# EasyEDA Pro project ProProject_Hi3861_v2.1_2024-07-26.epro, board PCB1
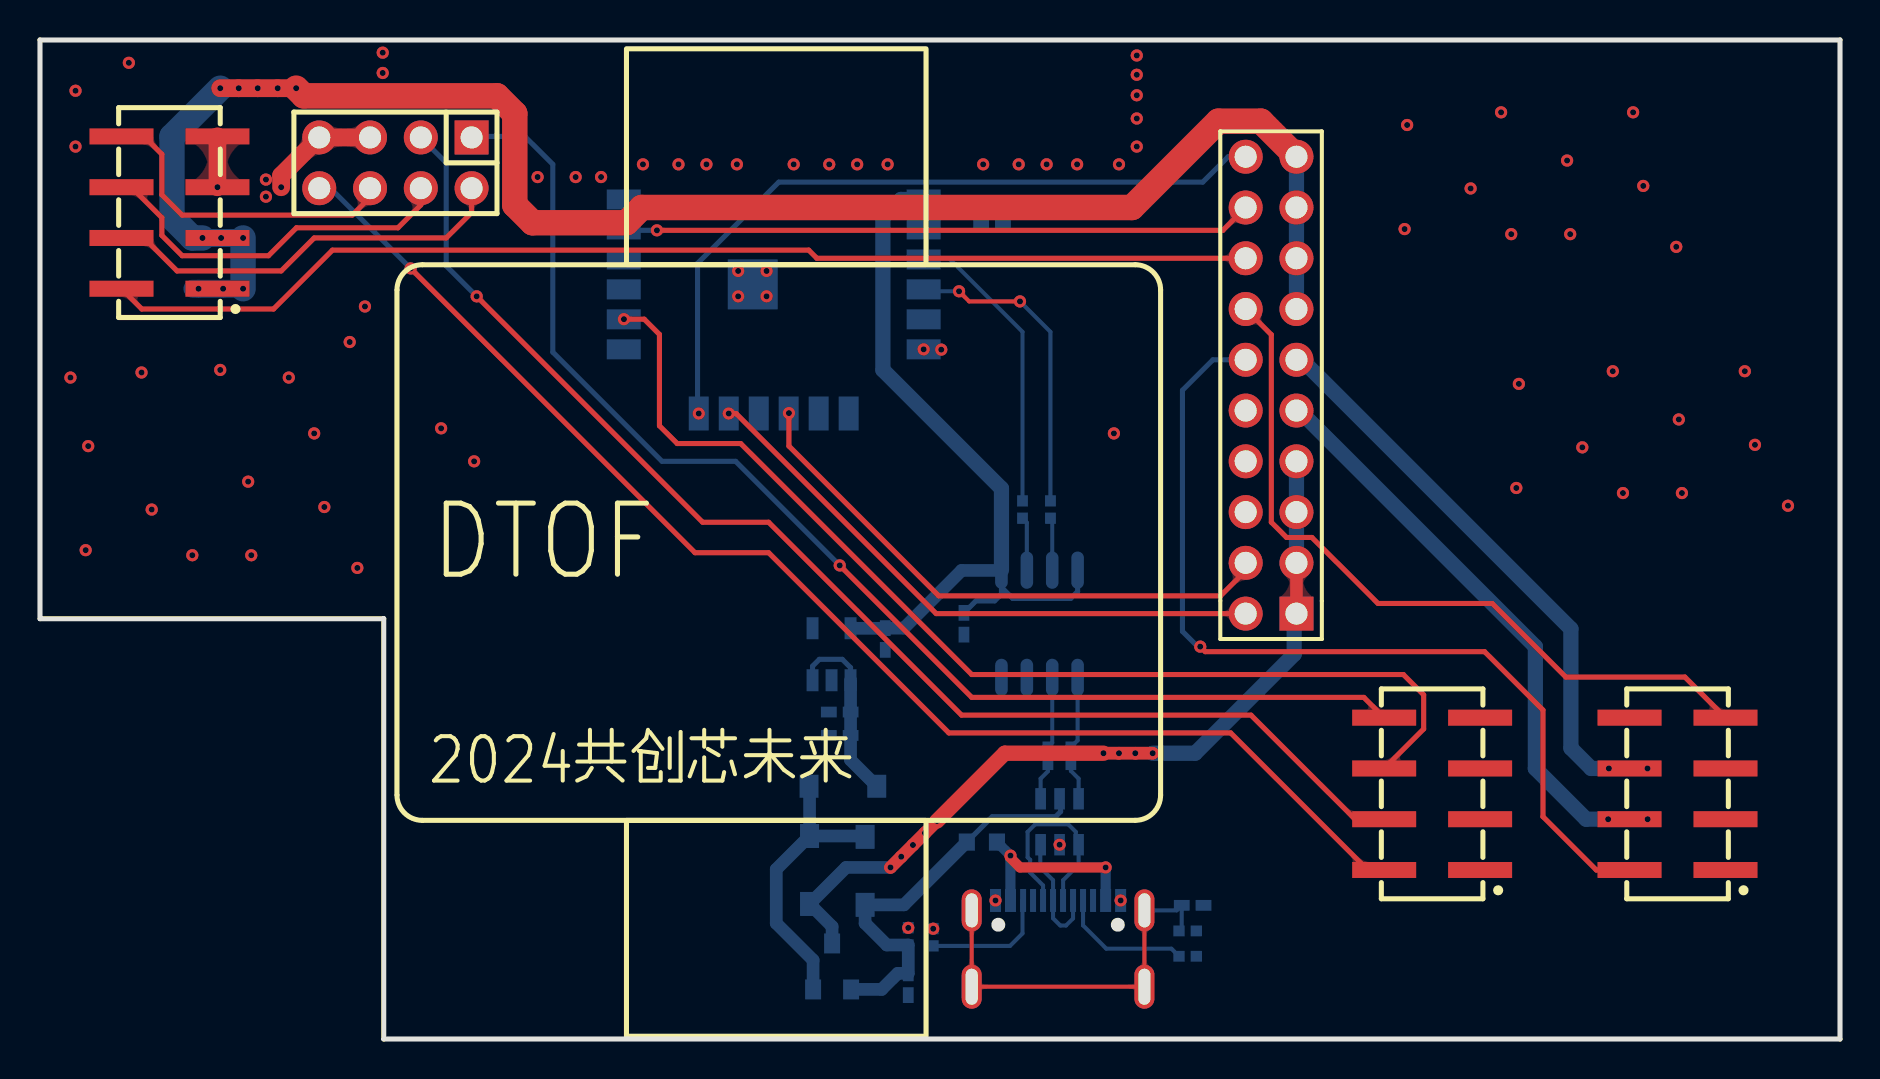
[diagram p6: board, top side]
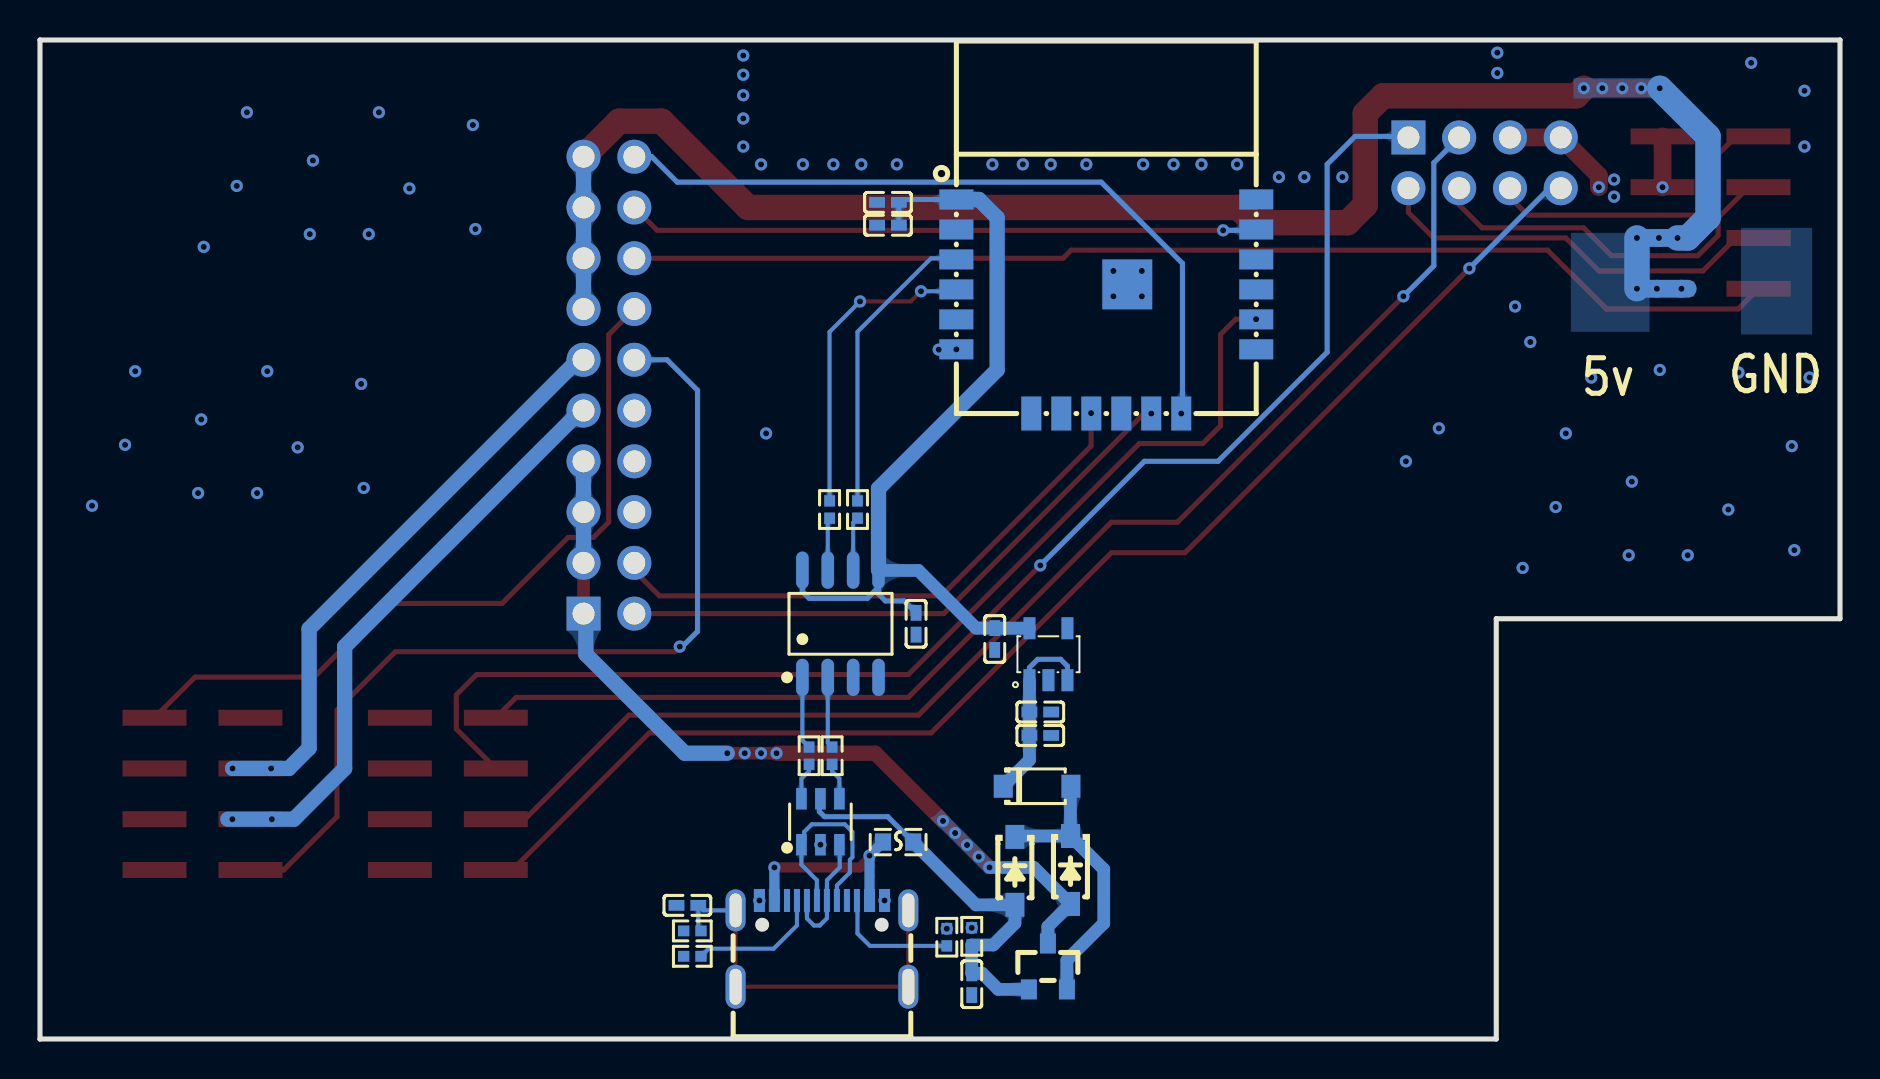
[diagram p7: board, bottom side, seen from below]

Outline 90.04 x 49.99 mm; copper layers: Top Layer, Bottom Layer. Coordinates in mm from the lower left corner of the outline.
Outline path: 0,49.99 0,21.03 17.2,21.03 17.2,0 90.04,0 90.04,49.99 0,49.99
Stack: Top Layer 0.035mm / Dielectric1 1.51mm FR4 er 4.5 / Bottom Layer 0.035mm

## Design rules (mm)
template: JLCPCB Capability(Two Layers Board)
spacing copperThickness1oz (default): track to track 0.102, other pairs 0.152 to 0.3
spacing copperThickness2oz: track to track 0.203, other pairs 0.152 to 0.3
track width copperThickness1oz (default): min 0.127, default 0.254, max 2.54
track width copperThickness2oz: min 0.203, default 0.254, max 2.54
differential pair differentialPair (default): width min 0.127, default 0.254, max 2.54; gap min 0.152, default 0.152
via viaSize (default): diameter min 0.5, default 0.61, max 10; hole min 0.3, default 0.305, max 6.3

## Placement (name value [footprint] x y rotation side)
C4  100nF  [C0402]  46.22 20.78 90 bottom
C12  47nf  [C0402]  43.43 2.74 90 bottom
C14  10u  [C0402]  40 15.19 180 bottom
C15  100nF  [C0402]  40 16.36 180 bottom
C16  10u  [C0402]  42.28 20.02 270 bottom
C28  2u  [C0402]  47.62 41.86 180 bottom
C29  100nF  [C0402]  47.62 40.72 180 bottom
C51  100nF  [C0402]  57.66 6.69 180 bottom
CN3  PM254-2-04-S-8.5  [HDR-SMD_8P-P2.54-V-F-R2-C4-S7.1]  69.64 12.27 90 top
CN4  PM254-2-04-S-8.5  [HDR-SMD_8P-P2.54-V-F-R2-C4-S7.1]  81.91 12.27 90 top
CN5  PM254-2-04-S-8.5  [HDR-SMD_8P-P2.54-V-F-R2-C4-S7.1]  6.48 41.35 90 top
D1  1N5819HW  [SOD-123_L2.7-W1.6-LS3.7-RD-1]  41.28 8.41 270 bottom
D2  1N5819HW  [SOD-123_L2.7-W1.6-LS3.7-RD-1]  38.5 8.46 270 bottom
D3  DSS24  [SOD-123_L2.8-W1.8-LS3.7-RD]  40.16 12.65 180 bottom
D6  USBLC6-2SC6  [SOT-23-6_L2.9-W1.6-P0.95-LS2.8-BL]  51 10.87 180 bottom
F2  ASMD0603-020  [F0603]  47.12 9.86 0 bottom
H1  PZ254V-12-20P  [HDR-TH_20P-P2.54-V-M-R2-C10-S2.54]  61.58 32.72 90 top
H2  PZ254V-12-8P  [HDR-TH_8P-P2.54-V-M-R2-C4-S2.54]  17.78 43.84 180 top
Q1  AO3401A  [SOT-23_L2.9-W1.3-P1.90-LS2.4-BR]  39.62 3.63 270 bottom
R3  10K  [R0402]  57.41 4.14 180 bottom
R4  10K  [R0402]  44.68 5.09 270 bottom
R9  100  [R0402]  50.55 26.49 90 bottom
R10  100  [R0402]  49.15 26.49 90 bottom
R16  10K  [R0402]  43.43 5.14 270 bottom
R20  100  [R0402]  51.57 14.17 90 bottom
R21  100  [R0402]  50.42 14.17 90 bottom
R34  10K  [R0402]  57.41 5.41 180 bottom
U1  LWY-S1H1  [WIFIM-SMD_L18.4-W15.0_LWY-S1H1]  36.7 36.65 180 bottom
U7  CH340N  [SOP-8_L4.9-W3.9-P1.27-LS6.0-BL]  50 20.78 180 bottom
U15  ME6217C33M5G  [SOT-23-5_L3.0-W1.7-P0.95-LS2.8-BR]  39.6 19.25 270 bottom
USB1  USB_hi3861  [USB-SMD_TYPEC-16PIN]  50.93 4.78 180 bottom

## Footprints (pads in the part's own frame, mm; a bottom-side part is the same pattern mirrored in y, then rotated)
C0402
  rect 0.79x0.54 smd: 1(-0.545,0) 2(0.545,0)
F0603
  rect 0.806x0.864 smd: 1(-0.753,0) 2(0.753,0)
HDR-SMD_8P-P2.54-V-F-R2-C4-S7.1
  rect 0.8x3.2 smd: 1(-3.81,-2.4) 2(-3.81,2.4) 3(-1.27,-2.4) 4(-1.27,2.4) 5(1.27,-2.4) 6(1.27,2.4) 7(3.81,-2.4) 8(3.81,2.4)
HDR-TH_8P-P2.54-V-M-R2-C4-S2.54
  rect 1.7x1.7 hole 1.1: 1(-3.81,-1.27)
  round 1.7 hole 1.1: 2(-3.81,1.27) 3(-1.27,-1.27) 4(-1.27,1.27) 5(1.27,-1.27) 6(1.27,1.27) 7(3.81,-1.27) 8(3.81,1.27)
HDR-TH_20P-P2.54-V-M-R2-C10-S2.54
  rect 1.7x1.7 hole 1.1: 1(-11.43,-1.27)
  round 1.7 hole 1.1: 2(-11.43,1.27) 3(-8.89,-1.27) 4(-8.89,1.27) 5(-6.35,-1.27) 6(-6.35,1.27) 7(-3.81,-1.27) 8(-3.81,1.27) 9(-1.27,-1.27) 10(-1.27,1.27) 11(1.27,-1.27) 12(1.27,1.27) 13(3.81,-1.27) 14(3.81,1.27) 15(6.35,-1.27) 16(6.35,1.27) 17(8.89,-1.27) 18(8.89,1.27) 19(11.43,-1.27) 20(11.43,1.27)
R0402
  rect 0.566x0.54 smd: 1(-0.433,0) 2(0.433,0)
SOD-123_L2.7-W1.6-LS3.7-RD-1
  rect 1.2x0.95 smd: 1(-1.7,0) 2(1.7,0)
SOD-123_L2.8-W1.8-LS3.7-RD
  rect 0.95x1.15 smd: 1(-1.692,0) 2(1.692,0)
SOP-8_L4.9-W3.9-P1.27-LS6.0-BL
  oval 0.63x1.865 smd: 1(-1.905,-2.683) 2(-0.635,-2.683) 3(0.635,-2.683) 4(1.905,-2.683) 5(1.905,2.683) 6(0.635,2.683) 7(-0.635,2.683) 8(-1.905,2.683)
SOT-23-5_L3.0-W1.7-P0.95-LS2.8-BR
  rect 1.1x0.6 smd: 1(1.3,-0.95) 2(1.3,0) 3(1.3,0.95) 4(-1.3,0.95) 5(-1.3,-0.95)
SOT-23-6_L2.9-W1.6-P0.95-LS2.8-BL
  rect 0.532x1.072 smd: 1(-0.95,-1.149) 2(0,-1.149) 3(0.95,-1.149) 4(0.95,1.149) 5(0,1.149) 6(-0.95,1.149)
SOT-23_L2.9-W1.3-P1.90-LS2.4-BR
  rect 1x0.8 smd: 1(1.15,-0.95) 2(1.15,0.95) 3(-1.15,0)
USB-SMD_TYPEC-16PIN
  oval 1x2.1 hole 0.6x1.7: 12(-4.32,1.663) 13(4.32,1.663)
  oval 1x2.2 hole 0.6x1.8: 14(-4.32,-2.158) 15(4.32,-2.158)
  rect 0.55x1.15 smd: A1B12(-3.13,2.158) A4B9(-2.38,2.158) B1A12(3.131,2.158) B4A9(2.38,2.158)
  rect 0.3x1.15 smd: A5(-1.25,2.158) A6(-0.25,2.158) A7(0.25,2.158) A8(1.25,2.158) B5(1.75,2.158) B6(0.75,2.158) B7(-0.75,2.158) B8(-1.75,2.158)
WIFIM-SMD_L18.4-W15.0_LWY-S1H1
  rect 1.7x1 smd: 1(-7.5,5.355) 2(-7.5,3.855) 3(-7.5,2.355) 4(-7.5,0.855) 5(-7.5,-0.645) 6(-7.5,-2.145) 13(7.5,-2.145) 14(7.5,-0.645) 15(7.5,0.855) 16(7.5,2.355) 17(7.5,3.855) 18(7.5,5.355)
  rect 1x1.7 smd: 7(-3.75,-5.355) 8(-2.25,-5.355) 9(-0.75,-5.355) 10(0.75,-5.355) 11(2.25,-5.355) 12(3.75,-5.355)
  rect 2.5x2.5 smd: 19(1.05,1.105)

## Nets
As in the schematic.

Pads without a net: CN4 8; H1 10; U1 2 5 7 8 13 15 16; U7 4; U15 4; USB1 A8 B8

## Via types
v1: diameter 0.61, hole 0.305, Top Layer to Bottom Layer, 116 vias

## Routing (per net, layer and track width the routed paths; a pad name or vN(x,y) marks a point on that pad's centre or on a via; arc(x,y) is an arc through that point)
3.3V_3861: length 44.1
  Bottom Layer w0.254: U7.5 48.1,22.61 ; 48.1,22.61 48.1,22.26 47.75,21.92 46.82,21.92 C4.2 ; 48.1,22.61 48.66,22.05 51.56,22.05 51.91,22.39 U7.8 ; U1.1 46.93,42.01 C28.2 C29.2
  Bottom Layer w0.635: U7.5 48.08,23.44 46.1,23.44 43.22,20.56 C16.1 42.28,20.55 U15.5
  Bottom Layer w0.762: U1.1 43.07,42.01 42.16,41.1 42.16,33.48 48.1,27.55 U7.5
5V: length 86.3
  Top Layer w0.889: v1(9.02,47.57) v1(9.94,47.57) v1(10.89,47.57) v1(11.89,47.57) v1(12.81,47.57)
  Top Layer w1.27: H1.19 61.07,45.92 58.94,45.92 54.62,41.61 30.1,41.61 29.34,40.84 24.64,40.84 23.75,41.73 23.75,46.3 22.86,47.19 13.2,47.19 v1(12.81,47.57)
  Bottom Layer w0.762: H1.13 H1.15 H1.17 H1.19
  Bottom Layer w0.889: v1(10.16,40.08) v1(9.06,40.08) v1(8.13,40.08) ; 7.62,37.54 v1(7.93,37.54) v1(9.16,37.54) v1(10.16,37.54)
  Bottom Layer w1.27: v1(9.02,47.57) 6.6,45.16 6.6,41.1 7.62,40.08 v1(8.13,40.08) ; v1(10.16,40.08) v1(10.16,37.54)
GND: length 8.4
  Top Layer w0.889: 8.88,45.16 v1(8.88,42.62) ; H2.5 H2.7 12.06,43.21 v1(12.06,42.62)
  vias: v1(1.52,33.1) v1(1.78,47.45) v1(1.78,44.65) v1(2.29,24.46) v1(2.41,29.67) v1(4.44,48.84) v1(5.08,33.35) v1(5.59,26.49) v1(7.62,24.21) v1(9.02,33.48) v1(10.41,27.89) v1(10.57,24.21) v1(11.3,43) v1(11.3,42.15) v1(12.45,33.1) v1(13.72,30.3) v1(14.22,26.62) v1(15.49,34.87) v1(15.88,23.57) v1(16.26,36.65) v1(17.14,49.35) v1(17.14,48.34) v1(20.07,30.56) v1(21.72,28.91) v1(24.89,43.13) v1(26.8,43.13) v1(28.07,43.13) v1(30.16,43.76) v1(31.94,43.76) v1(33.34,43.76) v1(34.86,43.76) v1(34.93,38.43) v1(34.93,37.16) v1(36.35,38.43) v1(36.35,37.16) v1(37.7,43.76) v1(39.48,43.76) v1(40.88,43.76) v1(42.4,43.76) v1(43.43,5.56) v1(44.2,34.51) v1(44.68,5.52) v1(45.09,34.49) v1(47.18,43.76) v1(47.8,6.93) v1(48.96,43.76) v1(50.36,43.76) v1(51,9.72) v1(51.88,43.76) v1(53.72,30.3) v1(53.97,43.76) v1(54.06,6.93) v1(54.86,49.21) v1(54.86,48.25) v1(54.86,47.22) v1(54.86,46.06) v1(54.86,44.65) v1(68.26,40.53) v1(68.39,45.73) v1(71.56,42.56) v1(73.09,46.37) v1(73.6,40.27) v1(73.85,27.57) v1(73.98,32.78) v1(76.39,43.95) v1(76.55,40.27) v1(77.15,29.6) v1(78.68,33.41) v1(79.18,27.32) v1(79.69,46.37) v1(80.2,42.68) v1(81.85,39.64) v1(81.98,31) v1(82.13,27.32) v1(85.28,33.41) v1(85.79,29.73) v1(87.44,26.68)
VBUS_3861: length 20.5
  Bottom Layer w0.254: F2.1 47.63,11.13 50.8,11.13 51.05,11.38 51.05,11.97 D6.5
  Bottom Layer w0.635: Q1.1 42.1,2.48 42.91,3.29 C12.2 R16.2 42.36,4.7 41.28,5.79 D1.2 43.22,6.71 F2.1
1PPS: length 67.4
  Top Layer w0.254: CN3.2 66.42,8.46 59.56,15.32 45.47,15.32 36.45,24.33 32.77,24.33 v1(18.54,38.56)
  Bottom Layer w0.254: v1(18.54,38.56) 14.53,42.57 13.97,42.57
8266_BUSY: length 63.2
  Top Layer w0.254: CN3.8 66.22,17.09 46.61,17.09 v1(40,23.7)
  Bottom Layer w0.254: v1(40,23.7) 34.8,28.91 31.12,28.91 25.65,34.37 25.65,43.76 24.26,45.16 21.64,45.16 H2.1
8266_N: length 29.5
  Bottom Layer w0.762: v1(80.41,13.54) v1(78.48,13.54) 77.6,13.54 76.58,14.55 76.58,20.52 63.12,33.99 H1.11
8266_P: length 29.8
  Bottom Layer w0.762: 80.65,11 v1(78.44,11) 77.34,11 74.8,13.54 74.8,19.63 62.99,31.45 H1.9
  vias: v1(80.42,11)
BAT+: length 41.6
  Top Layer w0.635: v1(42.54,8.59) v1(43.08,9.12) v1(43.67,9.71) v1(44.27,10.31) v1(44.87,10.91) ; v1(55.66,14.3) v1(54.79,14.3) v1(53.97,14.3) v1(53.2,14.3) ; H1.1 H1.3
  Top Layer w0.762: v1(44.87,10.91) 48.26,14.3 v1(53.2,14.3)
  Bottom Layer w0.635: 39.62,4.78 39.62,5.63 D2.2 40.32,8.59 v1(42.54,8.59)
  Bottom Layer w0.762: v1(55.66,14.3) 57.78,14.3 62.74,19.25 62.74,21.17 H1.1 ; H1.7 H1.5 H1.3
IP5306_KEY: length 58
  Top Layer w0.254: H1.16 38.86,39.07 38.46,39.47 14.63,39.47 11.68,36.53 5.09,36.53 CN5.2
LED1: length 20.6
  Top Layer w0.254: 21.59,42.57 21.59,41.35 20.32,40.08 13.72,40.08 12.06,38.43 6.86,38.43 5.21,40.08 CN5.4
LED2: length 18.8
  Top Layer w0.254: CN5.6 4.57,42.62 6.1,41.1 6.1,40.21 7.11,39.19 11.43,39.19 12.83,40.59 17.91,40.59 19.05,41.73 19.05,42.57
LED3: length 16.1
  Top Layer w0.254: 16.51,42.57 16.51,42.11 15.62,41.22 7.11,41.22 6.1,42.24 6.1,44.27 5.21,45.16 CN5.8
MCU_RX/03_TX: length 38
  Top Layer w0.254: CN4.7 82.28,18.11 76.33,18.11 72.64,21.79 66.93,21.79 63.63,25.1 62.36,25.1 61.59,25.86 61.59,35.24 H1.14
MCU_TX/03_RX: length 46.3
  Top Layer w0.254: v1(58.04,19.63) 58.29,19.38 72.26,19.38 75.18,16.46 75.18,11.13 77.85,8.46 CN4.2
  Bottom Layer w0.254: v1(58.04,19.63) 57.91,19.63 57.15,20.4 57.15,32.46 58.67,33.99 H1.12
NRST: length 65.3
  Top Layer w0.254: v1(21.84,37.16) 33.15,25.86 36.45,25.86 46.1,16.21 60.58,16.21 65.79,11 CN3.4
  Bottom Layer w0.254: v1(21.84,37.16) 20.32,38.68 20.32,43.84 H2.3
PWO: length 55
  Top Layer w0.254: v1(29.21,36.02) 30.23,36.02 30.99,35.26 30.99,30.68 31.88,29.79 35.05,29.79 46.61,18.24 68.2,18.24 69.22,17.22 69.22,15.51 CN3.6
  Bottom Layer w0.254: U1.14 29.2,36.01 v1(29.21,36.02)
UART0_RX3861: length 15
  Bottom Layer w0.203: R10.2 49.15,35.38 45.47,39.07 44.26,39.07 U1.3
UART0_TX3861: length 15.7
  Top Layer w0.203: v1(45.97,37.41) 46.48,36.91 v1(49.02,36.91)
  Bottom Layer w0.203: U1.4 44.3,37.41 v1(45.97,37.41) ; R9.2 50.55,35.38 v1(49.02,36.91)
UART1_RX3861/TOF_TX: length 31.6
  Top Layer w0.254: H1.18 59.17,40.46 v1(30.86,40.46)
  Bottom Layer w0.254: v1(30.86,40.46) 29.25,40.46 U1.17
UART1_TX3861/TOF_RX: length 37.2
  Bottom Layer w0.254: v1(32.95,31.3) 32.89,31.36 32.89,38.81 36.96,42.88 58.17,42.88 59.44,44.15 H1.20
UART_RX3861/UART_TX32: length 28.5
  Top Layer w0.254: H1.4 60.31,23.43 59.06,22.17 44.96,22.17 37.47,29.67 v1(37.47,31.32)
UART_TX3861/UART_RX32: length 30
  Top Layer w0.254: v1(34.45,31.3) 34.82,31.3 44.83,21.29 H1.2
USB_N3861: length 3.6
  Bottom Layer w0.203: U7.2 50.64,14.82 50.42,14.61
USB_N_3861: length 6.1
  Bottom Layer w0.203: D6.3 50.04,9.71 50.04,8.59 50.68,7.95 USB1.A7 50.68,6.04 51.04,5.68 51.32,5.68 51.68,6.03 USB1.B7
USB_P3861: length 3.6
  Bottom Layer w0.203: U7.1 51.91,14.94 51.57,14.61
USB_P_3861: length 10.3
  Bottom Layer w0.203: USB1.A6 51.18,6.94 51.18,7.95 51.95,8.72 D6.1 51.82,9.86 51.82,10.36 51.44,10.74 49.78,10.74 49.4,10.36 49.4,9.09 49.53,8.97 49.53,8.33 50.18,7.68 USB1.B6
VB3861: length 14.4
  Bottom Layer w0.635: D2.1 38.5,12.63 D3.2 ; D2.1 41.23,10.16 D1.1 ; D2.1 36.83,8.49 36.83,5.79 38.67,3.95 Q1.2
$1N1594: length 6.4
  Bottom Layer w0.203: USB1.B5 49.15,6.9 49.15,5.28 48.53,4.66 R4.2
$1N1597: length 6.7
  Bottom Layer w0.203: USB1.A5 52.18,5.68 53.34,4.52 56.6,4.52 56.98,4.14
$1N1598: length 9.9
  Top Layer w0.508: v1(53.31,8.59) 49.02,8.59 48.51,9.09
  Bottom Layer w0.508: USB1.B4A9 v1(48.55,9.18) F2.2 ; USB1.A4B9 v1(53.31,8.59)
$1N1606: length 19.6
  Top Layer w0.203: USB1.13 USB1.15 USB1.14 USB1.12
  Bottom Layer w0.203: 56.98,5.41 57.11,5.54 C51.2 56.86,6.44 USB1.12
$1N1725: length 1.9
  Bottom Layer w0.203: R20.1 51.57,13.42 51.95,13.03 D6.6
$1N1728: length 1.9
  Bottom Layer w0.203: R21.1 50.42,13.39 50.05,13.03 D6.4
$1N1923: length 9.4
  Bottom Layer w0.254: U15.3 38.65,18.66 38.99,19 40.13,19 40.55,18.58 U15.1
  Bottom Layer w0.635: D3.1 40.55,13.96 U15.1
$1N2088: length 2.6
  Bottom Layer w0.203: U7.7 50.64,25.97 R9.1
$1N2091: length 2.7
  Bottom Layer w0.203: R10.1 49.37,25.84 U7.6

## Copper pours and planes (outline as drawn; the poured copper is in the pictures)
5V on Bottom Layer: 8.64,48.08 13.33,48.08 13.33,47.07 8.64,47.07
5V on Bottom Layer: 9.53,40.34 13.46,40.34 13.46,35.38 9.53,35.38
GND on Top Layer: -1.02,53.92 91.57,53.92 91.57,-8.94 -1.02,-8.94
GND on Bottom Layer: -5.33,51.77 95.12,51.77 95.12,-2.08 -5.33,-2.08
GND on Bottom Layer: 1.4,40.59 4.95,40.59 4.95,35.26 1.4,35.26
BAT+ on Bottom Layer: 42.12,11.51 45.47,11.51 45.47,8.2 42.12,8.2
BAT+ on Bottom Layer: 52.71,14.68 52.71,13.92 56.06,13.92 56.06,14.63 56.01,14.68

Small or netless copper shapes (teardrops, artwork), in the pictures only: 43 on Top Layer, 99 on Bottom Layer

## Text on the board
Bottom Silkscreen Layer: GND | 5v
Top Silkscreen Layer: DTOF | 2024共创芯未来
